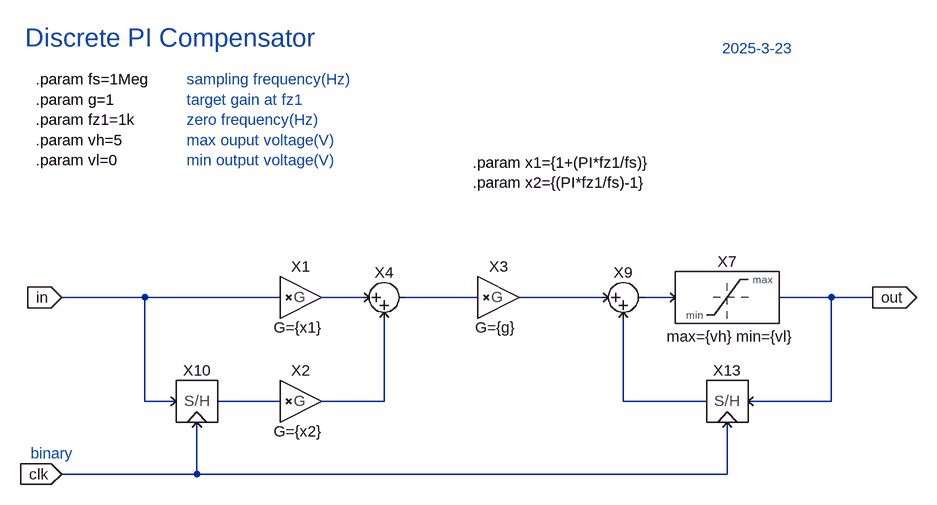
[diagram p0: schematic zPI.asc]
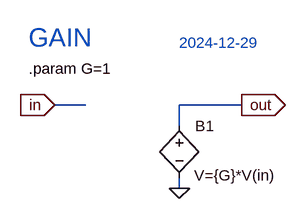
[diagram p1: sub-circuit gain.asc]
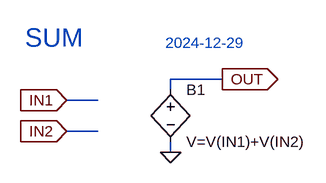
[diagram p2: sub-circuit sum.asc]
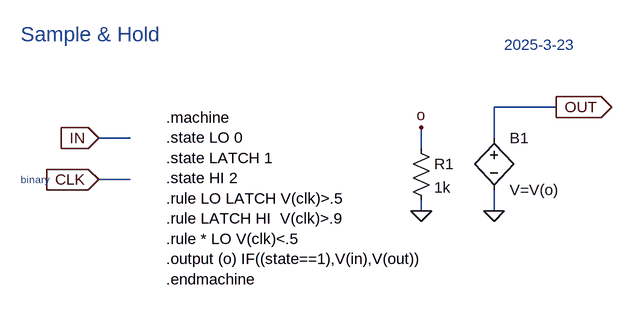
[diagram p3: sub-circuit samplehold.asc]
zPI.asc, the LTspice schematic file:
Version 4
SHEET 1 2928 680
WIRE -272 96 -400 96
WIRE -64 96 -272 96
WIRE 64 96 0 96
WIRE 240 96 128 96
WIRE 432 96 304 96
WIRE 544 96 496 96
WIRE 784 96 704 96
WIRE 848 96 784 96
WIRE -272 256 -272 96
WIRE -224 256 -272 256
WIRE -64 256 -160 256
WIRE 96 256 96 128
WIRE 96 256 0 256
WIRE 464 256 464 128
WIRE 592 256 464 256
WIRE 784 256 784 96
WIRE 784 256 656 256
WIRE -192 368 -192 288
WIRE -192 368 -400 368
WIRE 624 368 624 288
WIRE 624 368 -192 368
FLAG -400 368 clk
IOPIN -400 368 In
FLAG -400 96 in
IOPIN -400 96 In
FLAG 848 96 out
IOPIN 848 96 Out
SYMBOL PowerSim\\GAIN -32 96 R0
WINDOW 39 -4 62 Bottom 2
SYMATTR SpiceLine G={x1}
SYMATTR InstName X1
SYMBOL PowerSim\\GAIN -32 256 R0
WINDOW 39 -4 62 Bottom 2
SYMATTR SpiceLine G={x2}
SYMATTR InstName X2
SYMBOL PowerSim\\LIMIT 624 96 R0
WINDOW 39 5 76 Bottom 2
SYMATTR SpiceLine max={vh} min={vl}
SYMATTR InstName X7
SYMBOL PowerSim\\SUM 464 96 R0
SYMATTR InstName X9
SYMBOL PowerSim\\SAMPLEHOLD -192 256 R0
SYMATTR InstName X10
SYMBOL PowerSim\\SAMPLEHOLD 624 256 M0
SYMATTR InstName X13
SYMBOL PowerSim\\GAIN 272 96 R0
WINDOW 39 -4 62 Bottom 2
SYMATTR SpiceLine G={g}
SYMATTR InstName X3
SYMBOL PowerSim\\SUM 96 96 R0
SYMATTR InstName X4
TEXT -440 -240 Left 2 !.param fs=1Meg\n.param g=1\n.param fz1=1k\n.param vh=5\n.param vl=0
TEXT -456 -304 Left 4 ;Discrete PI Compensator
TEXT -208 -240 Left 2 ;sampling frequency(Hz)\ntarget gain at fz1\nzero frequency(Hz)\nmax ouput voltage(V)\nmin output voltage(V)
TEXT 616 -288 Left 2 ;2025-3-23
TEXT -448 336 Left 2 ;binary
TEXT 232 -112 Left 2 !.param x1={1+(PI*fz1/fs)}\n.param x2={(PI*fz1/fs)-1}

gain.asc, the sub-circuit schematic file:
Version 4
SHEET 1 880 680
WIRE 0 64 -48 64
WIRE 240 64 144 64
WIRE 144 96 144 64
WIRE 144 192 144 176
FLAG 144 192 0
FLAG 240 64 out
IOPIN 240 64 Out
FLAG -48 64 in
IOPIN -48 64 In
SYMBOL bv 144 80 R0
WINDOW 3 23 92 Left 2
SYMATTR Value V={G}*V(in)
SYMATTR InstName B1
TEXT -88 8 Left 2 !.param G=1
TEXT -88 -40 Left 4 ;GAIN
TEXT 144 -32 Left 2 ;2024-12-29

sum.asc, the sub-circuit schematic file:
Version 4
SHEET 1 880 680
WIRE 288 96 208 96
WIRE 208 112 208 96
WIRE 96 128 48 128
WIRE 96 176 48 176
WIRE 208 208 208 192
FLAG 48 128 IN1
IOPIN 48 128 In
FLAG 48 176 IN2
IOPIN 48 176 In
FLAG 208 208 0
FLAG 288 96 OUT
IOPIN 288 96 Out
SYMBOL bv 208 96 R0
SYMATTR InstName B1
SYMATTR Value V=V(IN1)+V(IN2)
TEXT -16 32 Left 4 ;SUM
TEXT 200 40 Left 2 ;2024-12-29

samplehold.asc, the sub-circuit schematic file:
Version 4
SHEET 1 880 680
WIRE 576 -560 480 -560
WIRE -80 -512 -128 -512
WIRE 480 -512 480 -560
WIRE 368 -496 368 -528
WIRE -80 -448 -128 -448
WIRE 368 -400 368 -416
WIRE 480 -400 480 -432
FLAG -128 -512 IN
IOPIN -128 -512 In
FLAG -128 -448 CLK
IOPIN -128 -448 In
FLAG 576 -560 OUT
IOPIN 576 -560 Out
FLAG 368 -400 0
FLAG 368 -528 o
FLAG 480 -400 0
SYMBOL res 352 -512 R0
SYMATTR InstName R1
SYMATTR Value 1k
SYMBOL bv 480 -528 R0
SYMATTR InstName B1
SYMATTR Value V=V(o)
TEXT -248 -672 Left 3 ;Sample & Hold
TEXT -248 -448 Left 1 ;binary
TEXT 496 -656 Left 2 ;2025-3-23
TEXT -24 -544 Left 2 !.machine\n.state LO 0\n.state LATCH 1\n.state HI 2\n.rule LO LATCH V(clk)>.5\n.rule LATCH HI  V(clk)>.9\n.rule * LO V(clk)<.5\n.output (o) IF((state==1),V(in),V(out))  \n.endmachine

The netlist it stands for:
* zPI.asc
XX1 in N001 gain params: G={x1}
XX2 N005 N006 gain params: G={x2}
XX7 N004 out LIMIT max={vh} min={vl}  ; pins in out
XX9 N003 N007 N004 sum
XX10 clk in N005 samplehold
XX13 clk out N007 samplehold
XX3 N002 N003 gain params: G={g}
XX4 N001 N006 N002 sum

* block symbol definitions
.subckt gain in out
B1 out 0 V={G}*V(in)
.param G=1
* GAIN
* 2024-12-29
.ends gain

.subckt sum in1 in2 out
B1 OUT 0 V=V(IN1)+V(IN2)
* SUM
* 2024-12-29
.ends sum

.subckt samplehold CLK IN OUT
R1 o 0 1k
B1 OUT 0 V=V(o)
* Sample & Hold
* binary
* 2025-3-23
.machine
.state LO 0
.state LATCH 1
.state HI 2
.rule LO LATCH V(clk)>.5
.rule LATCH HI  V(clk)>.9
.rule * LO V(clk)<.5
.output (o) IF((state==1),V(in),V(out))
.endmachine
.ends samplehold

.param fs=1Meg
.param g=1
.param fz1=1k
.param vh=5
.param vl=0
* Discrete PI Compensator
* sampling frequency(Hz)
* target gain at fz1
* zero frequency(Hz)
* max ouput voltage(V)
* min output voltage(V)
* 2025-3-23
* binary
.param x1={1+(PI*fz1/fs)}
.param x2={(PI*fz1/fs)-1}
.backanno
.end